# Altium schematic sheet connector.SchDoc: Connector Page
size A4; DrawnBy: Rémi St-Onge; Revision: 1
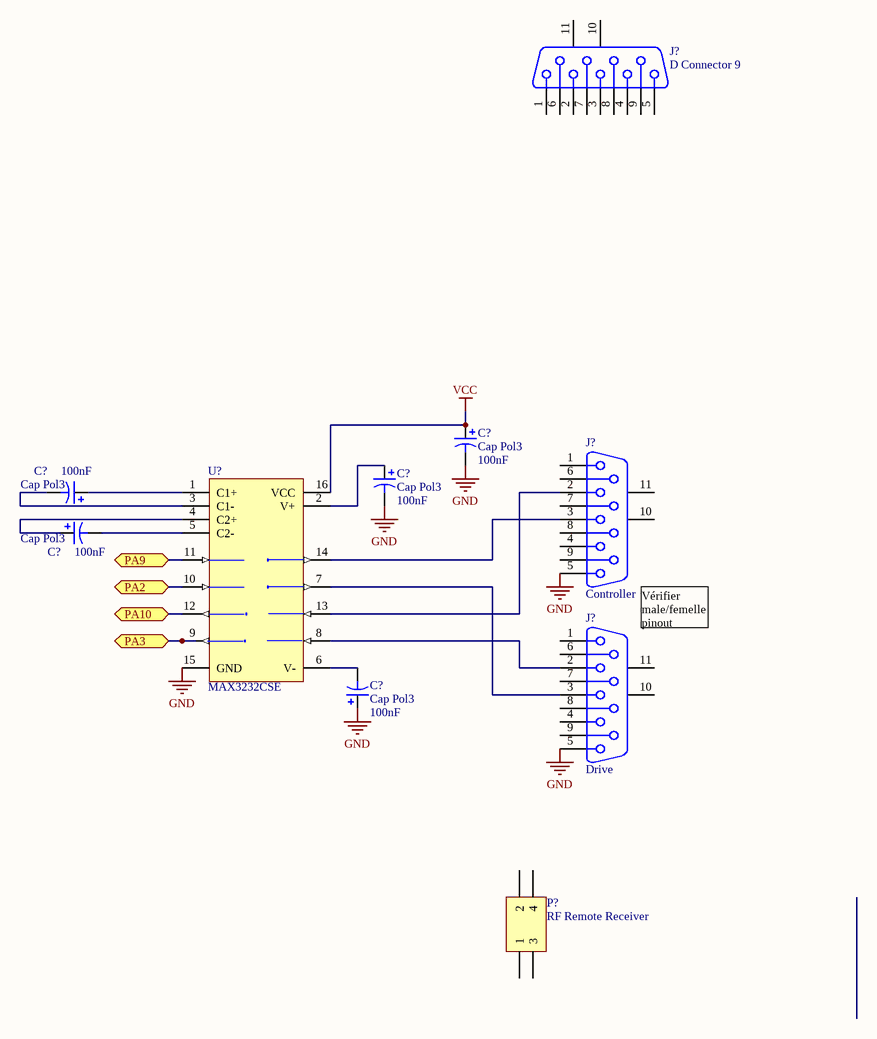
[diagram p0: connector.SchDoc]

## Parts
(Parts that share a designator on the sheet are numbered #1, #2 ... from top to bottom, then left to right.)
C?#1  Cap Pol3  value 100nF  [CAPC2012L]
C?#2  Cap Pol3  value 100nF  [CAPC2012L]
C?#3  Cap Pol3  value 100nF  [CAPC2012L]
C?#4  Cap Pol3  value 100nF  [CAPC2012L]
C?#5  Cap Pol3  value 100nF  [CAPC2012L]
J?#1  D Connector 9  [DSUB1.385-2H9]
J?#2  Controller  [DSUB1.385-2H9]
J?#3  Drive  [DSUB1.385-2H9]
P?  RF Remote Receiver  [HDR2X2]
U?  MAX3232CSE  [NSO16_M]

## Ports
PA2, PA3, PA9, PA10

## Nets
GND: C?#1.2 C?#2.2 C?#5.1 J?#2.5 J?#3.5 U?.15(GND)
VCC: C?#1.1 U?.16(VCC)
PA2: U?.10(T2IN) ; port PA2
PA3: U?.9(R2OUT) ; port PA3
PA9: U?.11(T1IN) ; port PA9
PA10: U?.12(R1OUT) ; port PA10
NetC?#2_1: C?#2.1 U?.2(V+)
NetC?#3_1: C?#3.1 U?.1(C1+)
NetC?#3_2: C?#3.2 U?.3(C1-)
NetC?#4_1: C?#4.1 U?.4(C2+)
NetC?#4_2: C?#4.2 U?.5(C2-)
NetC?#5_2: C?#5.2 U?.6(V-)
NetJ?#2_2: J?#2.2 U?.13(R1IN)
NetJ?#2_3: J?#2.3 U?.14(T1OUT)
NetJ?#3_2: J?#3.2 U?.8(R2IN)
NetJ?#3_3: J?#3.3 U?.7(T2OUT)

Not connected (* = marked no-connect by the designer): J?#1 1 2 3 4 5 6 7 8 9 10(MH1) 11(MH2); J?#2 1 4 6 7 8 9 10(MH1) 11(MH2); J?#3 1 4 6 7 8 9 10(MH1) 11(MH2); P? 1 2 3 4

## Notes on the sheet
- (near J?#2) Vérifier male/femelle pinout

## Library data of the parts
C?#1-C?#5 = Cap Pol3: Polarized Capacitor (Surface Mount); Published: 8-Jun-2000; LatestRevisionDate: 29-May-2009; LatestRevisionNote: IPC-7351 Footprint Added.; PackageReference: C0805; Publisher: Altium Limited; PackageDescription: Chip Capacitor
J?#1-J?#3 = D Connector 9: Receptacle Assembly, 9 Position, Right Angle; PackageDocument: O; Positions: 9; Published: 15-Jun-2001; LatestRevisionDate: 17-Jul-2002; LatestRevisionNote: Re-released for DXP Platform.; DatasheetDocument: 1-Sep-1999; PackageReference: 788750; Publisher: Altium Limited; Orientation: Right Angle; Gender: Receptacle
P? = Header 2X2: Header, 2-Pin, Dual row; LatestRevisionDate: 17-Jul-2002; LatestRevisionNote: Re-released for DXP Platform.; Publisher: Altium Limited
U? = MAX3232CSE: 3.0V TO 5.5V, Low-Power, up to 1Mbps, True RS-232 Transceiver Using Four 0.1µF External Capacitor; Published: 16-Jan-2001; LatestRevisionDate: 13-Apr-2006; LatestRevisionNote: IPC-7351 Footprint Added.; DatasheetVersion: Mar-1999; PackageReference: NSO16; Publisher: Altium Limited; PackageDescription: 16-Pin Small Outline Integrated Circuit 1.27 mm Pitch; Code_JEDEC: MS-012-AC; Code_IPC: SOIC127P600-16; ComponentLink1Description: Manufacturer Link; ComponentLink1URL: http://www.maxim-ic.com/; ComponentLink2Description: Datasheet; ComponentLink2URL: http://pdfserv.maxim-ic.com/en/ds/MAX3222-MAX3241.pdf